# EAGLE design DAq2017 (EAGLE 7.2.0)
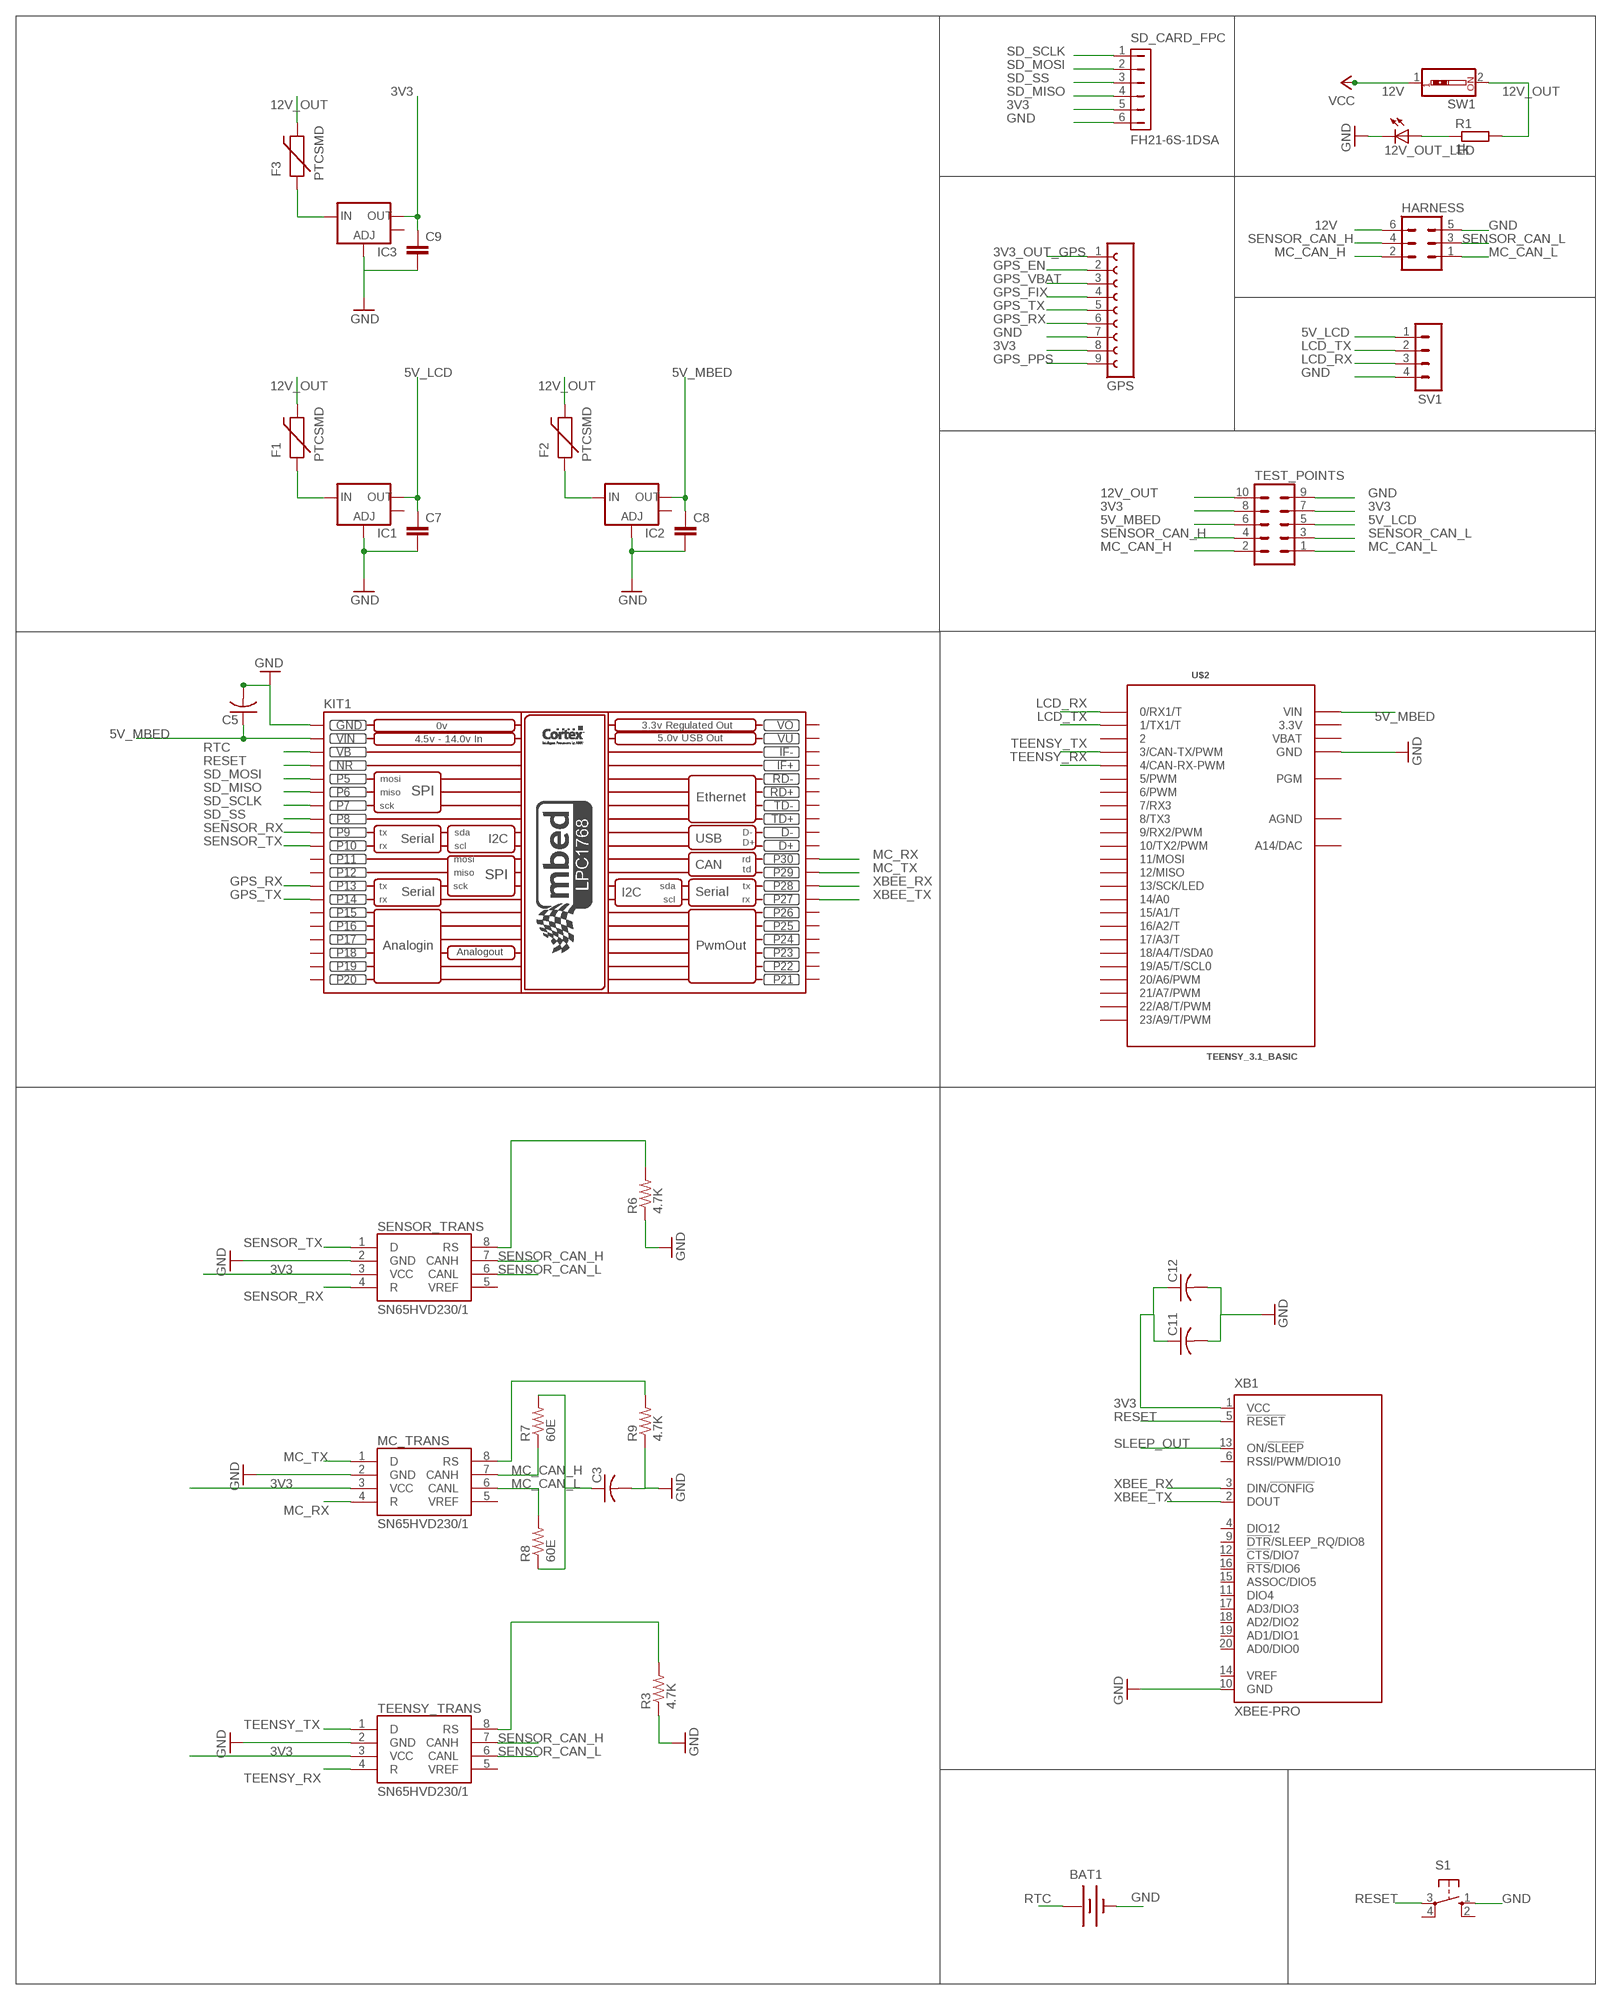
[diagram p0: schematic, sheet 1]

## Parts
12V_OUT_LED  LEDCHIPLED_1206  [CHIPLED_1206]
BAT1  BATTERY20PTH  [BATTCOM_20MM_PTH]
C3  C-USC0805  [C0805]
C5  C-USC0805  [C0805]
C7  C-EUC0805  [C0805]
C8  C-EUC0805  [C0805]
C9  C-EUC0805  [C0805]
C11  C-USC0805  [C0805]
C12  C-USC0805  [C0805]
F1  PTCSMD  [PTC-1206]
F2  PTCSMD  [PTC-1206]
F3  PTCSMD  [PTC-1206]
GPS  FE09-1  [FE09]
HARNESS  MA03-2  [MA03-2]
IC1  V_REG_LM1117SOT223  [SOT223]
IC2  V_REG_LM1117SOT223  [SOT223]
IC3  V_REG_LM1117SOT223  [SOT223]
KIT1  MBED_NXP_LPC1768  [MBED-KIT]
MC_TRANS  SN65HVD230/1  [SO8]
R1  1k  R-EU_R0805  [R0805]
R3  4.7K  R-US_R0805  [R0805]
R6  4.7K  R-US_R0805  [R0805]
R7  60E  R-US_R0805  [R0805]
R8  60E  R-US_R0805  [R0805]
R9  4.7K  R-US_R0805  [R0805]
S1  10-XX  [B3F-10XX]
SD_CARD_FPC  FH21-6S-1DSA  [FH21-6S-1DSA]
SENSOR_TRANS  SN65HVD230/1  [SO8]
SV1  MA04-1  [MA04-1]
SW1  SW_DIP-1  [EDG-01]
TEENSY_TRANS  SN65HVD230/1  [SO8]
TEST_POINTS  MA05-2  [MA05-2]
U$2  TEENSY_3.1_BASIC  [TEENSY_3.1_BASIC]
XB1  XBEE-PRO  [XBEE-PRO]

## Nets
3V3: C9.1 C11.1 C12.1 GPS.8 IC3.2(OUT) MC_TRANS.3(VCC) SD_CARD_FPC.5 SENSOR_TRANS.3(VCC) TEENSY_TRANS.3(VCC) TEST_POINTS.7 TEST_POINTS.8 XB1.1(VCC)
3V3_OUT_GPS: GPS.1
5V_LCD: C7.1 IC1.2(OUT) SV1.1 TEST_POINTS.5
5V_MBED: C5.1 C8.1 IC2.2(OUT) KIT1.VIN TEST_POINTS.6 U$2.VIN
12V: HARNESS.6 SW1.1 ; supply symbol labelled VCC
12V_OUT: F1.2 F2.2 F3.2 R1.2 SW1.2 TEST_POINTS.10
GND: 12V_OUT_LED.C BAT1.2(-) C3.2 C5.2 C7.2 C8.2 C9.2 C11.2 C12.2 GPS.7 HARNESS.5 IC1.1(ADJ) IC2.1(ADJ) IC3.1(ADJ) KIT1.GND MC_TRANS.2(GND) R3.1 R6.1 R9.1 S1.1(S) SD_CARD_FPC.6 SENSOR_TRANS.2(GND) SV1.4 TEENSY_TRANS.2(GND) TEST_POINTS.9 U$2.GND U$2.GND1(GND) XB1.10(GND)
GPS_EN: GPS.2
GPS_FIX: GPS.4
GPS_PPS: GPS.9
GPS_RX: GPS.6 KIT1.P$13(P13)
GPS_TX: GPS.5 KIT1.P$14(P14)
GPS_VBAT: GPS.3
LCD_RX: SV1.3 U$2.0(0/RX1/T)
LCD_TX: SV1.2 U$2.1(1/TX1/T)
MC_CAN_H: HARNESS.2 MC_TRANS.7(CANH) R7.1 TEST_POINTS.2
MC_CAN_L: HARNESS.1 MC_TRANS.6(CANL) R8.2 TEST_POINTS.1
MC_RX: KIT1.P$30(P30) MC_TRANS.4(R)
MC_TX: KIT1.P$29(P29) MC_TRANS.1(D)
N$4: R3.2 TEENSY_TRANS.8(RS)
N$5: 12V_OUT_LED.A R1.1
N$8: R6.2 SENSOR_TRANS.8(RS)
N$11: C3.1 R7.2 R8.1
N$12: MC_TRANS.8(RS) R9.2
N$14: F1.1 IC1.3(IN)
N$19: F2.1 IC2.3(IN)
N$24: F3.1 IC3.3(IN)
RESET: KIT1.NR S1.3(P) XB1.5(!RESET)
RTC: BAT1.1(+) KIT1.VB
SD_MISO: KIT1.P$6(P6) SD_CARD_FPC.4
SD_MOSI: KIT1.P$5(P5) SD_CARD_FPC.2
SD_SCLK: KIT1.P$7(P7) SD_CARD_FPC.1
SD_SS: KIT1.P$8(P8) SD_CARD_FPC.3
SENSOR_CAN_H: HARNESS.4 SENSOR_TRANS.7(CANH) TEENSY_TRANS.7(CANH) TEST_POINTS.4
SENSOR_CAN_L: HARNESS.3 SENSOR_TRANS.6(CANL) TEENSY_TRANS.6(CANL) TEST_POINTS.3
SENSOR_RX: KIT1.P$9(P9) SENSOR_TRANS.4(R)
SENSOR_TX: KIT1.P$10(P10) SENSOR_TRANS.1(D)
SLEEP_OUT: XB1.13(ON/!SLEEP)
TEENSY_RX: TEENSY_TRANS.4(R) U$2.4(4/CAN-RX-PWM)
TEENSY_TX: TEENSY_TRANS.1(D) U$2.3(3/CAN-TX/PWM)
XBEE_RX: KIT1.P$28(P28) XB1.3(DIN/!CONFIG)
XBEE_TX: KIT1.P$27(P27) XB1.2(DOUT)
Unconnected: IC1.4(OUT) IC2.4(OUT) IC3.4(OUT) KIT1.D+ KIT1.D- KIT1.IF+ KIT1.IF- KIT1.P$11(P11) KIT1.P$12(P12) KIT1.P$15(P15) KIT1.P$16(P16) KIT1.P$17(P17) KIT1.P$18(P18) KIT1.P$19(P19) KIT1.P$20(P20) KIT1.P$21(P21) KIT1.P$22(P22) KIT1.P$23(P23) KIT1.P$24(P24) KIT1.P$25(P25) KIT1.P$26(P26) KIT1.RD+ KIT1.RD- KIT1.TD+ KIT1.TD- MC_TRANS.5(VREF) S1.2(S1) S1.4(P1) SENSOR_TRANS.5(VREF) TEENSY_TRANS.5(VREF) U$2.2 U$2.5(5/PWM) U$2.6(6/PWM) U$2.7(7/RX3) U$2.8(8/TX3) U$2.9(9/RX2/PWM) U$2.10(10/TX2/PWM) U$2.11(11/MOSI) U$2.12(12/MISO) U$2.13(13/SCK/LED) U$2.14/A0 U$2.15/A1(15/A1/T) U$2.16/A2(16/A2/T) U$2.17/A3(17/A3/T) U$2.18/A4(18/A4/T/SDA0) U$2.19/A5(19/A5/T/SCL0) U$2.20/A6(20/A6/PWM) U$2.21/A7(21/A7/PWM) U$2.22/A8(22/A8/T/PWM) U$2.23/A9(23/A9/T/PWM) U$2.A14(A14/DAC) U$2.PGM XB1.4(DIO12) XB1.6(RSSI/PWM/DIO10) XB1.9(!DTR!/SLEEP_RQ/DIO8) XB1.11(DIO4) XB1.12(!CTS!/DIO7) XB1.14(VREF) XB1.15(ASSOC/DIO5) XB1.16(!RTS!/DIO6) XB1.17(AD3/DIO3) XB1.18(AD2/DIO2) XB1.19(AD1/DIO1) XB1.20(AD0/DIO0)

## Power pins joined to a net without a drawn wire
3.3V: U$2.3.3V U$2.3.3V1(3.3V)
AGND: U$2.AGND
VBAT: U$2.VBAT
VO: KIT1.VOUT(VO)
VU: KIT1.VU

## Library data of the parts
12V_OUT_LED = led:LED: LED OSRAM: - CHIPLED LG R971, LG N971, LY N971, LG Q971, LY Q971, LO R971, LY R971 LH N974, LH R974 LS Q976, LO Q976, LY Q976 LO Q996 - Hyper CHIPLED LW Q18S LB Q993, LB Q99A, LB R99A - SideLED LS A670, LO A670, LY A670, LG A670, LP A670 LB A673, LV A673, LT A673, LW A673 LH A674 LY A675 LS A676, LA A676, LO A676, LY A676, LW A676 LS A679, LY A679, LG A679 - Hyper Micro SIDELED® LS Y876, LA Y876, LO Y876, LY Y876 LT Y87S - SmartLED LW L88C, LW L88S LB L89C, LB L89S, LG L890 LS L89K, LO L89K, LY L89K LS L896, LA L896, LO L896, LY L896 - TOPLED LS T670, LO T670, LY T670, LG T670, LP T670 LSG T670, LSP T670, LSY T670, LOP T670, LYG T670 LG T671, LOG T671, LSG T671 LB T673, LV T673, LT T673, LW T673 LH T674 LS T676, LA T676, LO T676, LY T676, LB T676, LH T676, LSB T676, LW T676 LB T67C, LV T67C, LT T67C, LS T67K, LO T67K, LY T67K, LW E67C LS E67B, LA E67B, LO E67B, LY E67B, LB E67C, LV E67C, LT E67C LW T67C LS T679, LY T679, LG T679 LS T770, LO T770, LY T770, LG T770, LP T770 LB T773, LV T773, LT T773, LW T773 LH T774 LS E675, LA E675, LY E675, LS T675 LS T776, LA T776, LO T776, LY T776, LB T776 LHGB T686 LT T68C, LB T68C - Hyper Mini TOPLED® LB M676 - Mini TOPLED Santana® LG M470 LS M47K, LO M47K, LY M47K Source: http://www.osram.convergy.de LUXEON: - LUMILED® LXK2-PW12-R00, LXK2-PW12-S00, LXK2-PW14-U00, LXK2-PW14-V00 LXK2-PM12-R00, LXK2-PM12-S00, LXK2-PM14-U00 LXK2-PE12-Q00, LXK2-PE12-R00, LXK2-PE12-S00, LXK2-PE14-T00, LXK2-PE14-U00 LXK2-PB12-K00, LXK2-PB12-L00, LXK2-PB12-M00, LXK2-PB14-N00, LXK2-PB14-P00, LXK2-PB14-Q00 LXK2-PR12-L00, LXK2-PR12-M00, LXK2-PR14-Q00, LXK2-PR14-R00 LXK2-PD12-Q00, LXK2-PD12-R00, LXK2-PD12-S00 LXK2-PH12-R00, LXK2-PH12-S00 LXK2-PL12-P00, LXK2-PL12-Q00, LXK2-PL12-R00 Source: www.luxeon.com KINGBRIGHT: KA-3528ASYC Source: www.kingbright.com
BAT1 = SparkFun-Electromechanical:BATTERY: Battery Holders Various common sizes : AA, AAA, 18650 (PRT-12895), 20mm coin cell and 12mm coin cell. 20MM_4LEGS, BATT-10373
C3 C5 C11 C12 = resistor:C-US: CAPACITOR, American symbol
C7-C9 = Ediff+DAQ_v2:C-EU: CAPACITOR, European symbol
F1-F3 = Ediff+DAQ_v2:PTC: Resettable Fuse PTC Resettable Fuse. Spark Fun Electronics SKU : COM-08357
GPS = con-lsta:FE09-1: FEMALE HEADER; OC_FARNELL: unknown; OC_NEWARK: unknown
HARNESS = con-lstb:MA03-2: PIN HEADER; OC_FARNELL: unknown; OC_NEWARK: unknown
IC1-IC3 = dash:V_REG_LM1117: Voltage Regulator LM1117 Standard adjustable voltage regulator but in SMD form. Spark Fun Electronics SKU : COM-00595
KIT1 = Ediff+DAQ_v2:MBED_NXP_LPC1768: Mbed LPC1768 - ARM CORTEX v2.1 * Schematic symbol is now placed in eagles's default raster. *The pads diameter are suitable for routing between mbed pins * mbed pads are 0.8 mm drill diameter. --------------------------------------------- Created by: Mohamed Yousry *Alexandria, Egypt *Email: mohamed.yousry@ieeegoldegypt.org
MC_TRANS SENSOR_TRANS TEENSY_TRANS = texas_1:SN65HVD230/1
R1 = resistor:R-EU_: RESISTOR, European symbol
R3 R6-R9 = rcl:R-US_: RESISTOR, American symbol
S1 = switch-omron:10-XX: OMRON SWITCH; MPN: B3F-1000; OC_FARNELL: 176432; OC_NEWARK: 36M3542
SD_CARD_FPC = con-hirose:FH21-6S-1DSA: FPC CONNECTOR Source: con-hirose.lbr from Bob Starr <rtzaudio@mindspring.com>; OC_FARNELL: unknown; OC_NEWARK: unknown
SV1 = con-lstb:MA04-1: PIN HEADER; OC_FARNELL: unknown; OC_NEWARK: unknown
SW1 = special:SW_DIP-1: DIP SWITCH
TEST_POINTS = con-lstb:MA05-2: PIN HEADER; OC_FARNELL: unknown; OC_NEWARK: unknown
U$2 = LV:TEENSY_3.1_BASIC: Footprint for Teensy 3.1 board using all pin connections on the outer perimeter
XB1 = Ediff+DAQ_v2:XBEE: XBee (TM) /XBee-PRO(TM) OEM RF Modules Source: MaxStream, Inc. xbee_productmanual.pdf; MPN: XBP24-AWI-001; OC_FARNELL: 1337916; OC_NEWARK: 42M2667

## Board
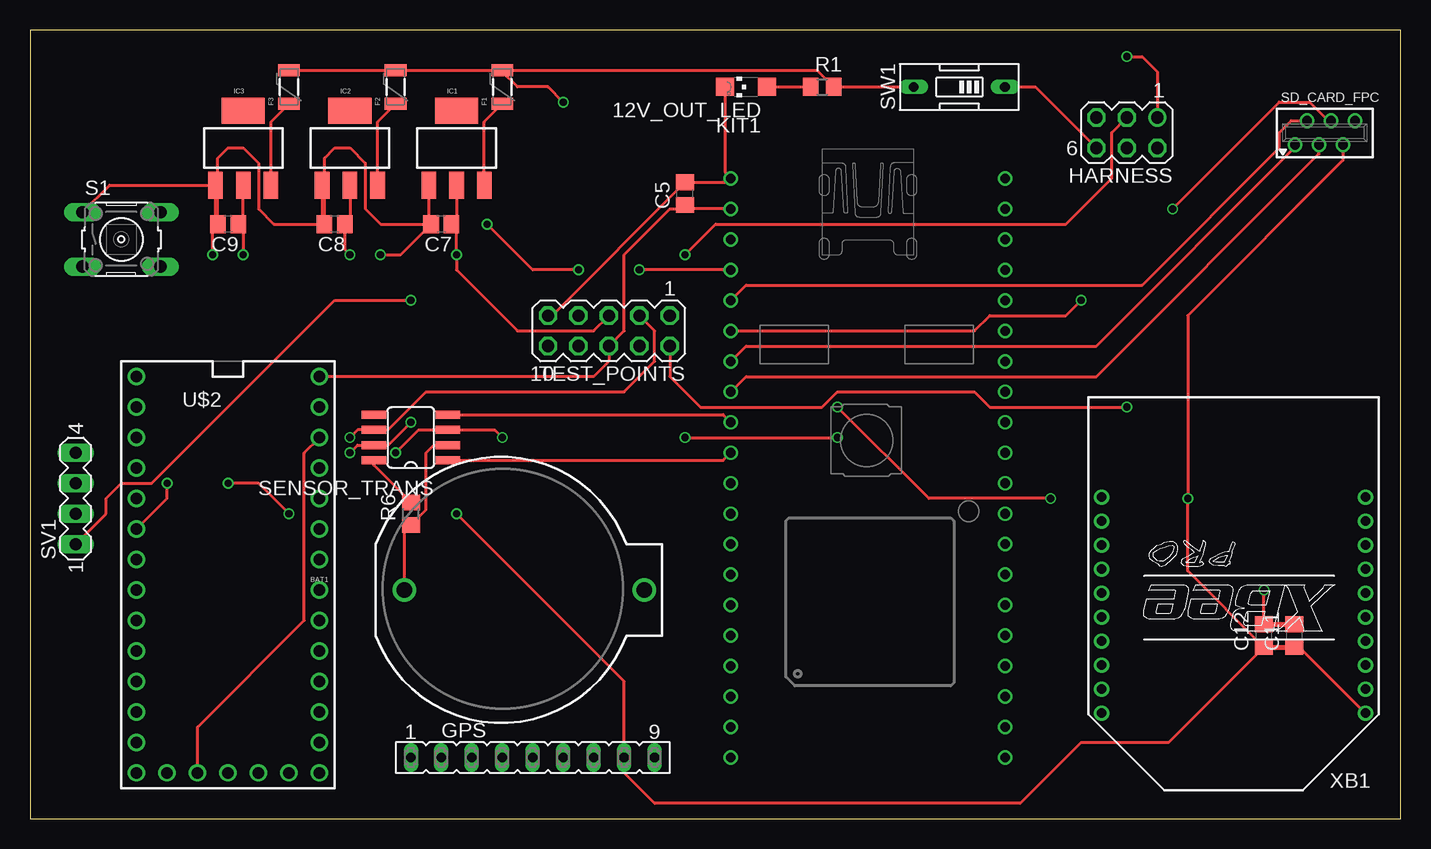
[diagram p1: board, top side]
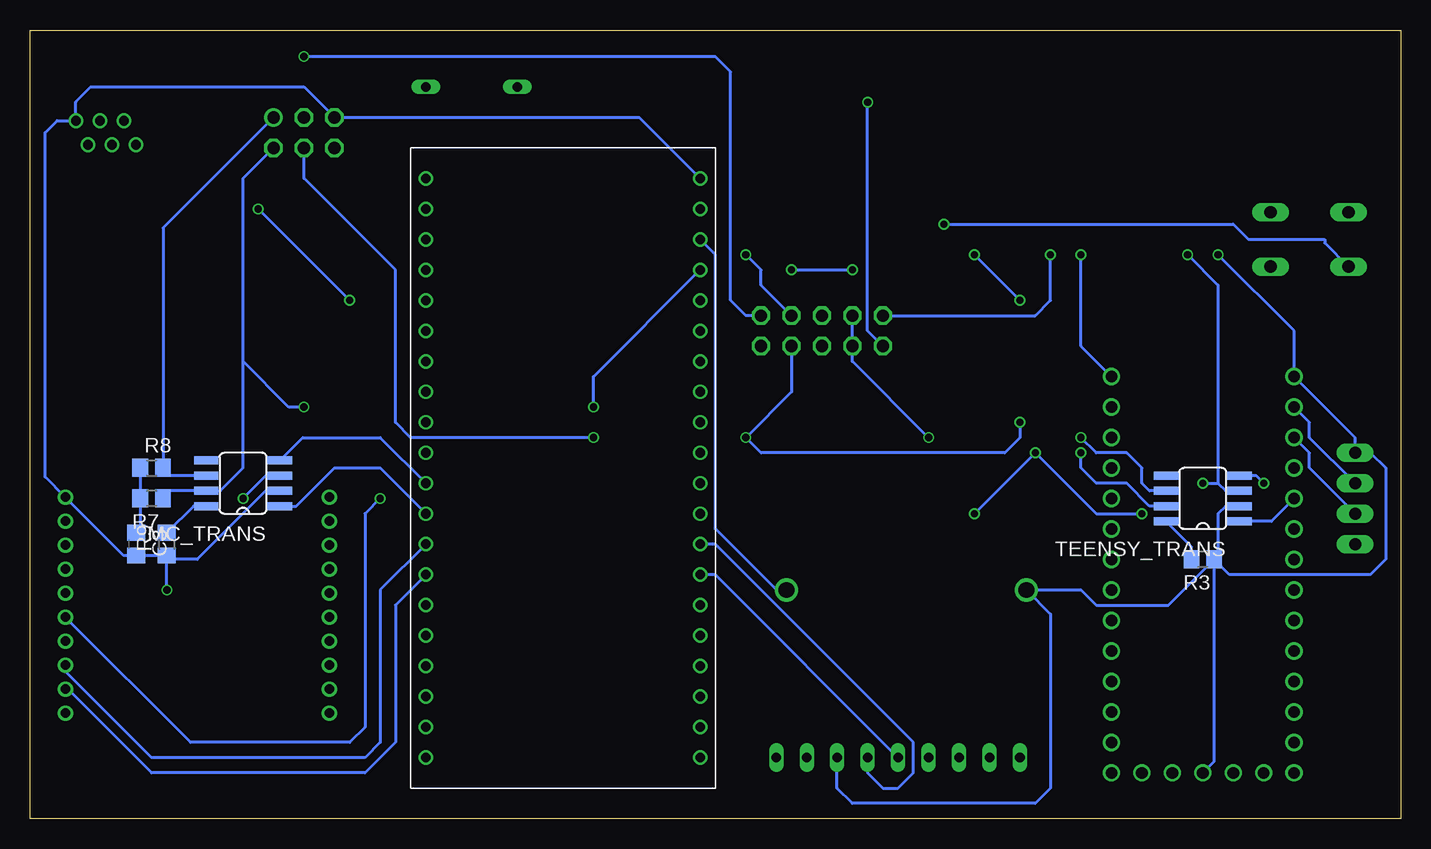
[diagram p2: board, bottom side, seen from below]

Size 114.28 x 65.71 mm. Coordinates in mm from the lower left corner, seen from the top.
Outline: 0,0 114.28,0 114.28,65.71 0,65.71 0,0
Copper layers (1*16): Top 0.035mm / dielectric 1.5mm / Bottom 0.035mm
Design rules "PCB_Power": minimum track width 5mil, minimum drill 10mil, track to track 5mil, track to pad 5mil, pad to pad 5mil, via to via 5mil, smd to smd 5mil, copper to edge 10mil, drill to drill 6mil, minimum pad ring 5mil, minimum via ring 5mil, stop-mask expansion 3mil, vias tented up to drill 0mil, thermal gap 10mil

### Footprints (pad centres in the part's own frame; a part is rotated, then mirrored left to right if it is on the bottom)
CHIPLED_1206 = smd 1.5 x 1.5: A 0,-1.75; C 0,1.75
BATTCOM_20MM_PTH = drill 1.3: 1 11.85,0; 2 -8.15,0
C0805 = smd 1.3 x 1.5: 1 -0.95,0; 2 0.95,0
C0805' = smd 1.3 x 1.5: 1 -0.85,0; 2 0.85,0
PTC-1206 = smd 1 x 1.8: 1 -1.4,0; 2 1.4,0
FE09 = drill 0.813 long: 1 -10.16,0; 2 -7.62,0; 3 -5.08,0; 4 -2.54,0; 5 0,0; 6 2.54,0; 7 5.08,0; 8 7.62,0; 9 10.16,0
MA03-2 = drill 1.016: 1 -2.54,-1.27 | drill 1.016 octagon: 2 -2.54,1.27; 3 0,-1.27; 4 0,1.27; 5 2.54,-1.27; 6 2.54,1.27
SOT223 = smd 1.219 x 2.235: 1 -2.311,-3.099; 2 0,-3.099; 3 2.311,-3.099 | smd 3.6 x 2.2: 4 0,3.099
MBED-KIT = drill 0.8: D+ 11.43,1.27; D- 11.43,3.81; GND -11.43,24.13; IF+ 11.43,16.51; IF- 11.43,19.05; NR -11.43,16.51; P$5 -11.43,13.97; P$6 -11.43,11.43; P$7 -11.43,8.89; P$8 -11.43,6.35; P$9 -11.43,3.81; P$10 -11.43,1.27; P$11 -11.43,-1.27; P$12 -11.43,-3.81; P$13 -11.43,-6.35; P$14 -11.43,-8.89; P$15 -11.43,-11.43; P$16 -11.43,-13.97; P$17 -11.43,-16.51; P$18 -11.43,-19.05; P$19 -11.43,-21.59; P$20 -11.43,-24.13; P$21 11.43,-24.13; P$22 11.43,-21.59; P$23 11.43,-19.05; P$24 11.43,-16.51; P$25 11.43,-13.97; P$26 11.43,-11.43; P$27 11.43,-8.89; P$28 11.43,-6.35; P$29 11.43,-3.81; P$30 11.43,-1.27; RD+ 11.43,11.43; RD- 11.43,13.97; TD+ 11.43,6.35; TD- 11.43,8.89; VB -11.43,19.05; VIN -11.43,21.59; VOUT 11.43,24.13; VU 11.43,21.59
SO8 = smd 0.66 x 2.032: 1 -1.905,-3.073; 2 -0.635,-3.073; 3 0.635,-3.073; 4 1.905,-3.073; 5 1.905,3.073; 6 0.635,3.073; 7 -0.635,3.073; 8 -1.905,3.073
R0805 = smd 1.3 x 1.5: 1 -0.95,0; 2 0.95,0
B3F-10XX = drill 1.016 long: 1 -3.251,2.261; 2 3.251,2.261; 3 -3.251,-2.261; 4 3.251,-2.261
FH21-6S-1DSA = drill 0.813: 1 -2.5,-1; 2 -1.5,1; 3 -0.5,-1; 4 0.5,1; 5 1.5,-1; 6 2.5,1
MA04-1 = drill 1.016 long: 1 -3.81,0; 2 -1.27,0; 3 1.27,0; 4 3.81,0
EDG-01 = drill 0.813 long: 1 0,-3.81; 2 0,3.81
MA05-2 = drill 1.016 octagon: 1 -5.08,-1.27; 2 -5.08,1.27; 3 -2.54,-1.27; 4 -2.54,1.27; 5 0,-1.27; 6 0,1.27; 7 2.54,-1.27; 8 2.54,1.27; 9 5.08,-1.27; 10 5.08,1.27
TEENSY_3.1_BASIC = drill 0.965: 0 -7.62,13.97; 1 -7.62,11.43; 2 -7.62,8.89; 3 -7.62,6.35; 3.3V 7.62,11.43; 3.3V1 -2.54,-16.51; 4 -7.62,3.81; 5 -7.62,1.27; 6 -7.62,-1.27; 7 -7.62,-3.81; 8 -7.62,-6.35; 9 -7.62,-8.89; 10 -7.62,-11.43; 11 -7.62,-13.97; 12 -7.62,-16.51; 13 7.62,-16.51; 14/A0 7.62,-13.97; 15/A1 7.62,-11.43; 16/A2 7.62,-8.89; 17/A3 7.62,-6.35; 18/A4 7.62,-3.81; 19/A5 7.62,-1.27; 20/A6 7.62,1.27; 21/A7 7.62,3.81; 22/A8 7.62,6.35; 23/A9 7.62,8.89; A14 5.08,-16.51; AGND 7.62,13.97; GND -7.62,16.51; GND1 0,-16.51; PGM 2.54,-16.51; VBAT -5.08,-16.51; VIN 7.62,16.51
XBEE-PRO = drill 0.8 pad 1.27: 1 -11,9; 2 -11,7; 3 -11,5; 4 -11,3; 5 -11,1; 6 -11,-1; 7 -11,-3; 8 -11,-5; 9 -11,-7; 10 -11,-9; 11 11,-9; 12 11,-7; 13 11,-5; 14 11,-3; 15 11,-1; 16 11,1; 17 11,3; 18 11,5; 19 11,7; 20 11,9

### Placement (x,y rotation side)
12V_OUT_LED  59.69,60.96 90 top
BAT1  39.37,19.05 0 top
C3  105.41,22.86 270 bottom
C5  54.61,52.07 90 top
C7  [C0805']  34.29,49.53 180 top
C8  [C0805']  25.4,49.53 180 top
C9  [C0805']  16.51,49.53 180 top
C11  105.41,15.24 90 top
C12  102.87,15.24 90 top
F1  39.37,60.96 90 top
F2  30.48,60.96 90 top
F3  21.59,60.96 90 top
GPS  41.91,5.08 0 top
HARNESS  91.44,57.15 180 top
IC1  35.56,55.88 0 top
IC2  26.67,55.88 0 top
IC3  17.78,55.88 0 top
KIT1  69.85,29.21 0 top
MC_TRANS  96.52,27.94 90 bottom
R1  66.04,60.96 0 top
R3  16.51,21.59 180 bottom
R6  31.75,25.4 90 top
R7  104.14,26.67 180 bottom
R8  104.14,29.21 0 bottom
R9  102.87,22.86 90 bottom
S1  7.62,48.26 0 top
SD_CARD_FPC  107.95,57.15 0 top
SENSOR_TRANS  31.75,31.75 90 top
SV1  3.81,26.67 90 top
SW1  77.47,60.96 90 top
TEENSY_TRANS  16.51,26.67 90 bottom
TEST_POINTS  48.26,40.64 180 top
U$2  16.51,20.32 0 top
XB1  100.33,17.78 180 top

### Tracks (layer width: path | path; a pad name or v marks a point on that pad's centre or on a via)
3.3V
  Top 0.254: U$2.3.3V1 13.97,7.62 22.86,16.51 22.86,30.48 U$2.3.3V
3V3  (via drill 0.6)
  Top 0.254: C11.1 105.82,14.29 XB1.1 | SD_CARD_FPC.5 109.45,54.84 96.52,41.91 v96.52,26.67 96.52,20.64 C12.1 94.93,6.35 87.63,6.35 82.55,1.27 52.07,1.27 49.53,3.81 GPS.8 49.53,11.43 v35.56,25.4 | IC3.2 17.78,49.95 C9.1 17.78,49.11 v17.78,46.99 | v30.48,30.48 32.38,32.38 SENSOR_TRANS.3 38.73,32.38 v39.37,31.75 | v21.59,25.4 19.05,27.94 v16.51,27.94
  Top 0.406: C12.1 C11.1
  Bottom 0.254: v96.52,26.67 94.61,28.57 MC_TRANS.3 | v17.78,46.99 15.24,44.45 15.24,27.94 | 15.24,27.94 14.61,27.3 TEENSY_TRANS.3 | v21.59,25.4 25.4,25.4 v30.48,30.48 v35.56,25.4 | v16.51,27.94 15.24,27.94 | v39.37,31.75 45.72,38.1 TEST_POINTS.8 TEST_POINTS.7
5V_LCD  (via drill 0.6)
  Top 0.254: IC1.2 35.56,49.95 C7.1 35.56,49.11 v35.56,46.99 35.56,45.72 40.64,40.64 46.99,40.64 TEST_POINTS.5 | SV1.1 6.35,25.4 6.35,26.67 7.62,27.94 10.16,27.94 25.4,43.18 v31.75,43.18
  Bottom 0.254: v31.75,43.18 v35.56,46.99
5V_MBED  (via drill 0.6)
  Top 0.254: KIT1.VIN 54.93,50.8 C5.1 54.61,50.8 53.34,50.8 49.53,46.99 49.53,40.64 TEST_POINTS.6 48.26,38.1 46.99,36.83 U$2.VIN | IC2.2 26.67,49.95 C8.1 26.25,47.41 v26.67,46.99
  Bottom 0.254: v26.67,46.99 26.67,39.37 U$2.VIN
12V
  Top 0.254: SW1.1 83.82,60.96 HARNESS.6
12V_OUT  (via drill 0.6)
  Top 0.254: SW1.2 R1.2 65.59,62.36 F1.2 | F3.2 F2.2 F1.2 | v44.45,59.69 43.18,60.96 40.64,60.96 39.37,62.23 F1.2
  Bottom 0.254: TEST_POINTS.10 44.45,40.64 v44.45,59.69
GND  (via drill 0.6)
  Top 0.254: C12.2 v102.87,19.05 | 12V_OUT_LED.C 57.94,53.82 KIT1.GND 58.1,53.02 C5.2 43.5,41.91 TEST_POINTS.9 | S1.1 6.63,52.78 IC3.1 15.47,49.72 C9.2 | IC2.1 24.36,49.72 C8.2 | IC1.1 33.25,49.72 C7.2 | BAT1.2 31.22,23.92 R6.1 33.02,25.72 33.02,30.48 33.66,31.11 SENSOR_TRANS.2 | C9.2 15.66,55.03 16.51,55.88 17.78,55.88 19.05,54.61 19.05,50.8 20.32,49.53 C8.2 | C8.2 24.55,55.03 25.4,55.88 26.67,55.88 27.94,54.61 27.94,50.8 29.21,49.53 C7.2 | v15.24,46.99 15.24,49.53 C9.2 | v29.21,46.99 30.9,46.99 C7.2
  Top 0.406: C12.2 C11.2
  Bottom 0.254: R9.1 C3.2 106.46,21.91 XB1.10 113.03,28.48 113.03,57.15 112.03,58.15 SD_CARD_FPC.6 110.45,59.73 109.22,60.96 91.44,60.96 HARNESS.5 63.5,58.42 KIT1.GND | MC_TRANS.2 94.61,27.3 100.33,21.59 102.55,21.59 R9.1 | v102.87,19.05 R9.1 | TEENSY_TRANS.2 14.61,26.04 15.24,25.4 15.24,21.91 R3.1 | R3.1 15.56,4.76 U$2.GND1 | R3.1 19.37,17.78 25.4,17.78 26.67,19.05 BAT1.2 29.21,17.04 29.21,2.54 30.48,1.27 45.72,1.27 46.99,2.54 GPS.7 | v15.24,46.99 8.89,40.64 U$2.GND 3.81,31.75 SV1.4 2.54,30.48 1.27,29.21 1.27,21.59 2.54,20.32 14.29,20.32 R3.1 | TEST_POINTS.9 30.48,41.91 29.21,43.18 v29.21,46.99
GPS_RX
  Bottom 0.254: GPS.6 44.45,3.81 43.18,2.54 41.91,2.54 40.64,3.81 40.64,6.35 57.15,22.86 KIT1.P$13
GPS_TX
  Bottom 0.254: GPS.5 57.15,20.32 KIT1.P$14
LCD_RX
  Bottom 0.254: SV1.3 7.62,31.75 7.62,33.02 U$2.0
LCD_TX
  Bottom 0.254: SV1.2 7.62,29.21 7.62,30.48 U$2.1
MC_CAN_H  (via drill 0.6)
  Top 0.254: TEST_POINTS.2 53.34,36.83 55.88,34.29 66.04,34.29 67.31,35.56 78.74,35.56 80.01,34.29 v91.44,34.29
  Bottom 0.254: R7.1 102.56,27.3 MC_TRANS.7 98.42,27.3 96.52,29.21 96.52,38.1 | 96.52,38.1 96.52,53.34 HARNESS.2 | v91.44,34.29 92.71,34.29 96.52,38.1
MC_CAN_L  (via drill 0.6)
  Top 0.254: v91.44,63.5 92.71,63.5 93.98,62.23 HARNESS.1
  Bottom 0.254: MC_TRANS.6 102.56,28.57 R8.2 103.19,49.21 HARNESS.1 | TEST_POINTS.1 54.61,41.91 55.88,43.18 55.88,62.23 57.15,63.5 v91.44,63.5
MC_RX
  Bottom 0.254: MC_TRANS.4 91.54,31.75 85.09,31.75 KIT1.P$30
MC_TX
  Bottom 0.254: MC_TRANS.1 92.08,26.04 88.9,29.21 85.09,29.21 KIT1.P$29
N$4
  Bottom 0.254: R3.2 17.46,22.64 TEENSY_TRANS.8
N$5
  Top 0.254: 12V_OUT_LED.A R1.1
N$8
  Top 0.254: R6.2 28.68,29.42 SENSOR_TRANS.8
N$11
  Bottom 0.254: R8.1 R7.2 105.09,24.13 C3.1
N$12
  Bottom 0.254: MC_TRANS.8 100.64,26.04 R9.2
N$14
  Top 0.254: IC1.3 37.87,58.06 F1.1
N$19
  Top 0.254: IC2.3 28.98,58.06 F2.1
N$24
  Top 0.254: IC3.3 20.09,58.06 F3.1
RESET  (via drill 0.6)
  Top 0.254: v85.09,26.67 74.93,26.67 v67.31,34.29 | KIT1.NR v50.8,45.72 | v45.72,45.72 41.91,45.72 v38.1,49.53
  Bottom 0.254: v67.31,34.29 67.31,36.83 KIT1.NR | v50.8,45.72 v45.72,45.72 | v38.1,49.53 13.97,49.53 12.7,48.26 6.35,48.26 6.35,47.98 S1.3 | v85.09,26.67 86.36,25.4 86.36,7.62 87.63,6.35 100.9,6.35 XB1.5
RTC
  Bottom 0.254: BAT1.1 52.07,19.05 57.15,24.13 57.15,46.99 KIT1.VB
SD_MISO  (via drill 0.6)
  Top 0.254: v95.25,50.8 104.14,59.69 106.68,59.69 108.22,58.15 SD_CARD_FPC.4 | KIT1.P$6 78.74,40.64 80.01,41.91 86.36,41.91 v87.63,43.18
  Bottom 0.254: v87.63,43.18 v95.25,50.8
SD_MOSI
  Top 0.254: KIT1.P$5 59.69,44.45 92.71,44.45 104.14,55.88 104.14,57.15 105.14,58.15 SD_CARD_FPC.2
SD_SCLK
  Top 0.254: KIT1.P$7 59.69,39.37 88.9,39.37 105.45,55.92 SD_CARD_FPC.1
SD_SS
  Top 0.254: KIT1.P$8 59.69,36.83 88.9,36.83 107.45,55.38 SD_CARD_FPC.3
SENSOR_CAN_H  (via drill 0.6)
  Top 0.254: v26.67,30.48 27.3,31.11 SENSOR_TRANS.7 29.84,31.11 v31.75,33.02 | v54.61,31.75 v67.31,31.75
  Bottom 0.254: TEENSY_TRANS.7 20.95,26.04 22.86,27.94 25.4,27.94 26.67,29.21 v26.67,30.48 | TEST_POINTS.4 50.8,35.56 v54.61,31.75 53.34,30.48 33.02,30.48 31.75,31.75 v31.75,33.02 | v67.31,31.75 82.55,31.75 83.82,33.02 83.82,45.72 91.44,53.34 HARNESS.4
SENSOR_CAN_L  (via drill 0.6)
  Top 0.254: v54.61,46.99 57.15,49.53 86.36,49.53 90.17,53.34 90.17,57.15 HARNESS.3 | TEST_POINTS.3 52.07,40.64 52.07,38.1 49.53,35.56 33.02,35.56 29.84,32.38 SENSOR_TRANS.6 27.3,32.38 v26.67,31.75
  Bottom 0.254: TEENSY_TRANS.6 20.95,27.3 21.59,27.94 21.59,29.21 22.86,30.48 25.4,30.48 v26.67,31.75 | TEST_POINTS.3 53.34,44.45 53.34,45.72 v54.61,46.99
SENSOR_RX
  Top 0.254: SENSOR_TRANS.4 57.78,33.66 KIT1.P$9
SENSOR_TX
  Top 0.254: SENSOR_TRANS.1 57.78,29.84 KIT1.P$10
TEENSY_RX  (via drill 0.6)
  Top 0.254: v11.43,27.94 11.43,26.67 U$2.4
  Bottom 0.254: v11.43,27.94 12.06,28.57 TEENSY_TRANS.4
TEENSY_TX
  Bottom 0.254: TEENSY_TRANS.1 10.79,24.77 U$2.3
XBEE_RX
  Bottom 0.254: KIT1.P$28 85.09,19.05 85.09,6.35 86.36,5.08 104.14,5.08 111.33,12.27 XB1.3
XBEE_TX
  Bottom 0.254: KIT1.P$27 83.82,17.78 83.82,6.35 86.36,3.81 104.14,3.81 111.11,10.78 XB1.2